# EAGLE board Arduino101 (EAGLE 7.7.0), part 1 of 2
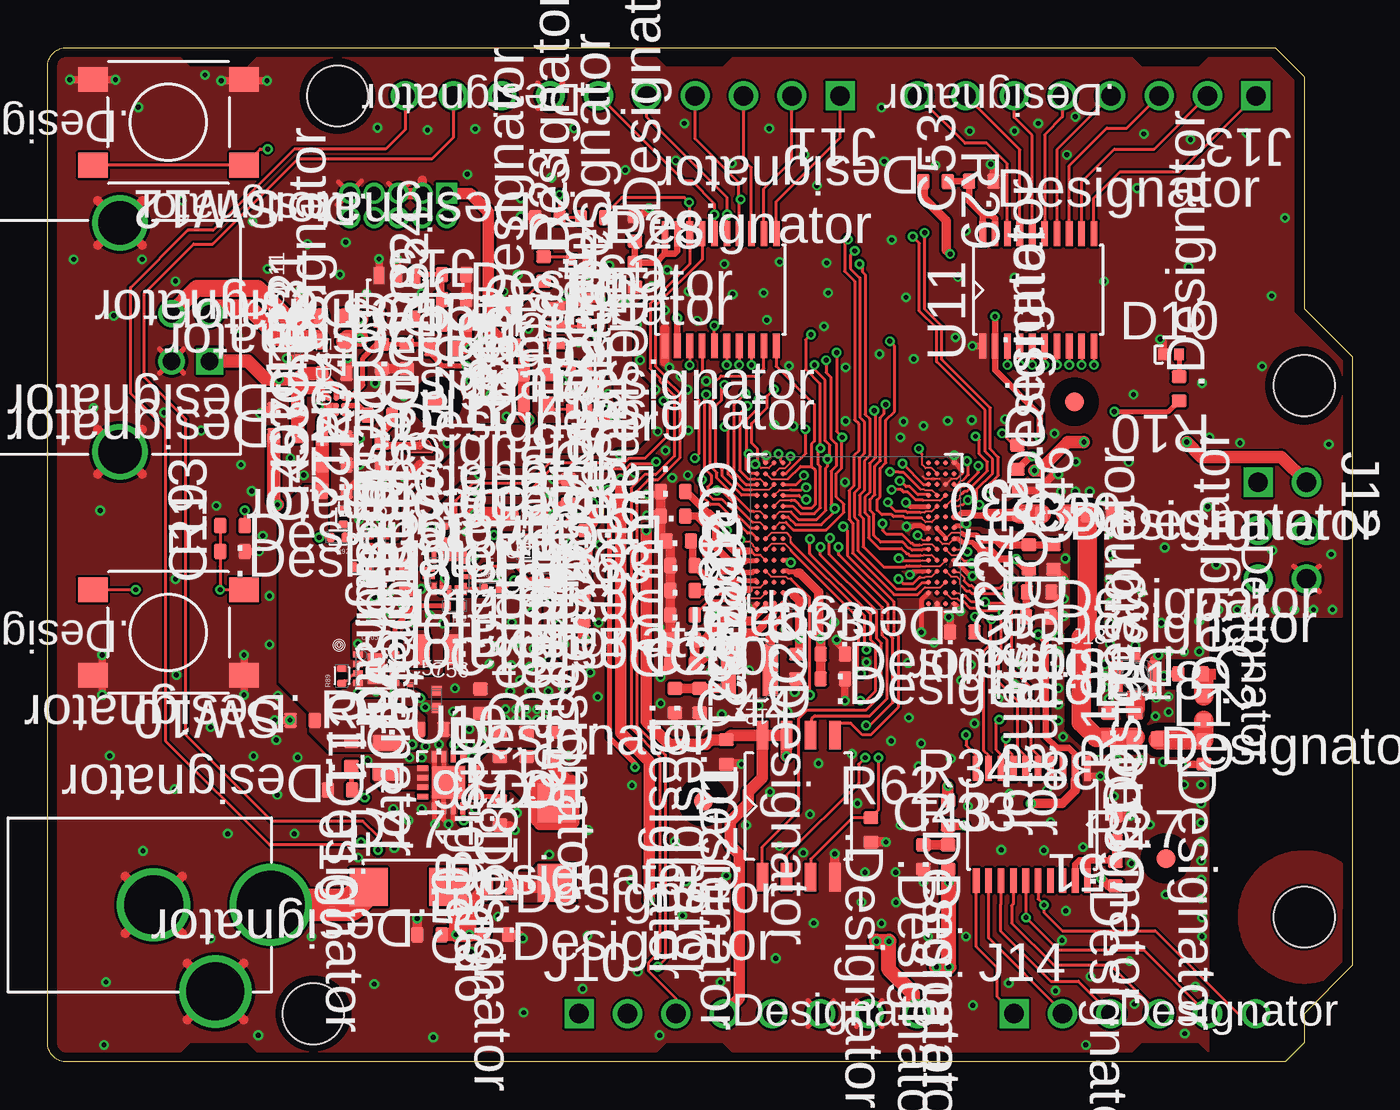
[diagram p6: board, top side]
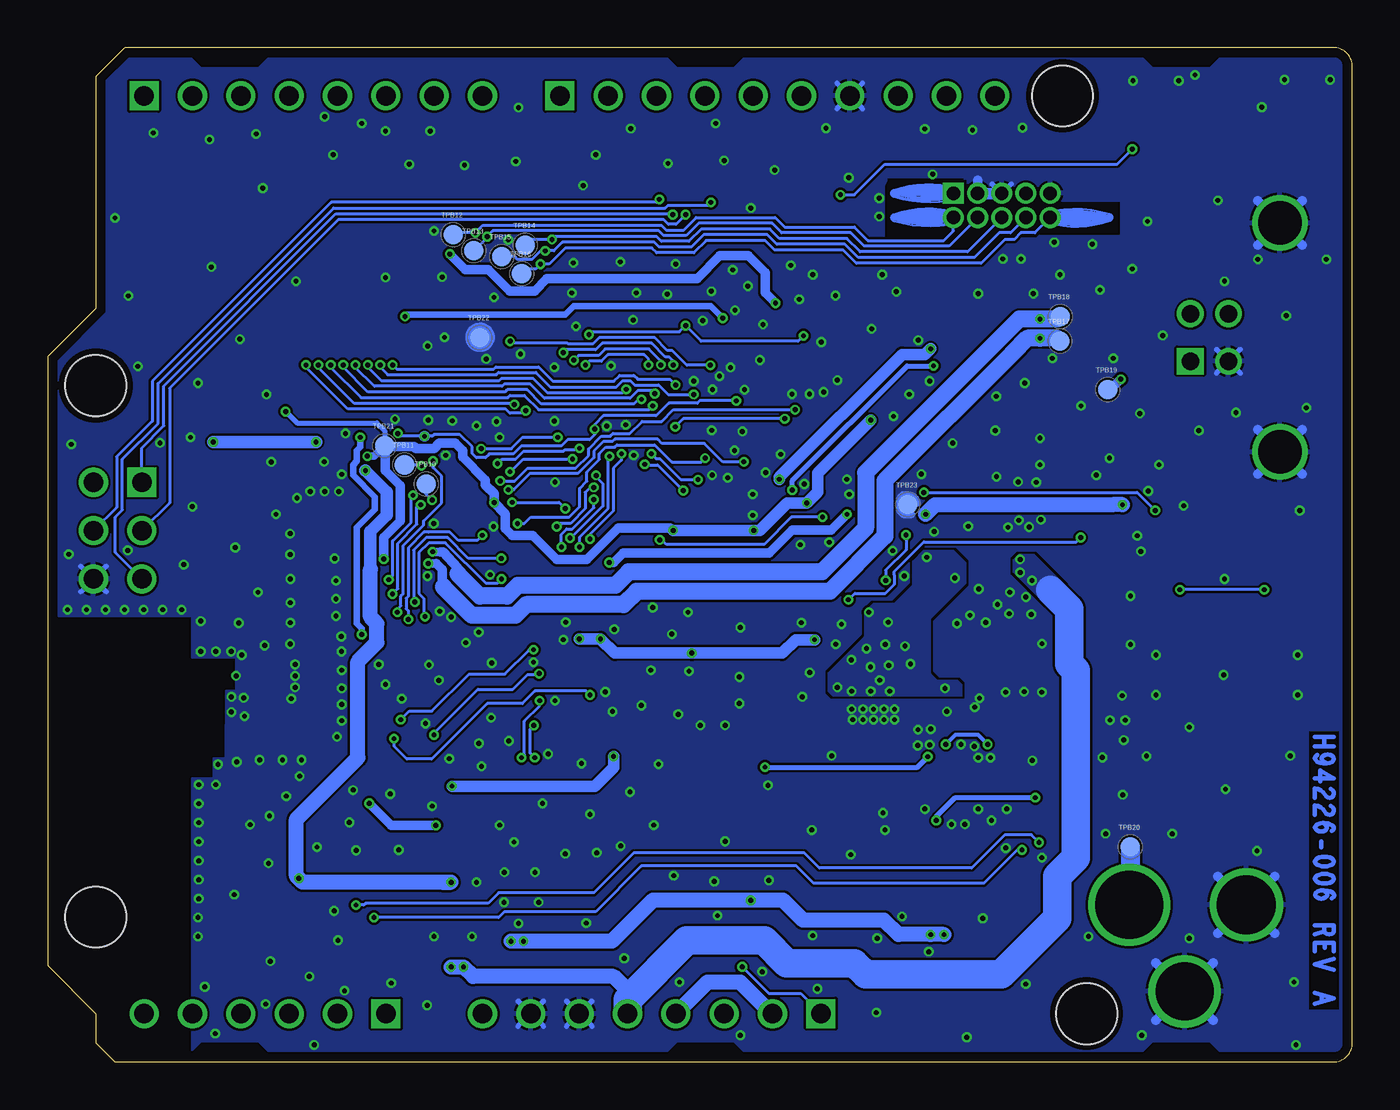
[diagram p7: board, bottom side, seen from below]

Size 68.58 x 53.34 mm. Coordinates in mm from the lower left corner, seen from the top.
Outline: 65.04,0 66.04,1 66.04,1.05 66.04,2.54 68.58,5.08 68.58,37.08 66.04,39.62 66.04,51.82 64.52,53.34 1,53.34 arc90 0,52.34 0,1 arc90 1,0 65.04,0
Copper layers (1+2+3*14+15+16): Top 0.035mm / dielectric 0.15mm / Route2 0.035mm / dielectric 0.15mm / Route3 0.035mm / dielectric 0.2mm / Route14 0.035mm / dielectric 0.15mm / Route15 0.035mm / dielectric 0.15mm / Bottom 0.035mm
Design rules "default *": minimum track width 0.075mm, minimum drill 0.25mm, track to track 5mil, track to pad 5mil, pad to pad 5mil, via to via 4mil, smd to smd 5mil, copper to edge 0.125mm, drill to drill 8mil, minimum pad ring 8mil, minimum via ring 5mil, stop-mask expansion 0mil, vias tented up to drill 20mil, thermal gap 5mil
Net classes: 0 default: width 0.102 mm, drill 0.203 mm; 1 RF: width 0.178 mm, drill 0.203 mm; 2 PWR: width 0.508 mm, drill 0.203 mm; 3 DIFF100: width 0.102 mm, drill 0.203 mm, clearance 0.157 mm
Holes 3.2 mm at 15.24,50.8 66.04,35.56 66.04,7.62 13.97,2.54
tRestrict: area 48.4,16.2 to 60,29.6; area 56.4,18 to 56.8,19.5; area 57.5,17.7 to 58,19.5; area 15,27.3 to 15.6,27.8; area 16.3,25.8 to 16.7,26.3; area 21.1,23.7 to 21.6,24.2; area 25.1,26.4 to 25.5,26.9; area 20.6,27.6 to 21.1,28; area 15.3,28.5 to 15.8,28.9; area 20.3,34.6 to 20.6,34.8; area 52.8,33.6 to 55.1,35.8; area 53.2,33.9 to 54.8,35.5; area 53.8,34.6 to 54.1,34.8; area 34.3,13.6 to 34.6,13.8; area 64.8,6.4 to 67.3,8.9; area 65.7,7.3 to 66.4,8; area 65.5,35.1 to 66.6,36.1; area 13.8,49.3 to 16.7,52.3; area 14.7,50.3 to 15.8,51.3; area 12.5,1.1 to 15.5,4; area 13.4,2 to 14.5,3.1; area 19.4,33.6 to 21.5,35.8; area 33.4,12.6 to 35.5,14.8; area 57.7,9.6 to 59.8,11.8; area 64.2,33.8 to 67.8,37.4; area 5.9,36.2 to 7.1,37.5; area 2.4,42.7 to 5.2,45.5; area 2.4,30.7 to 5.2,33.4; area 4.2,6.8 to 7,9.7; area 4.7,7.4 to 6.5,9.2; area 3.8,6.4 to 7.4,10.1; area 7,1.9 to 10.7,5.5; area 7.9,2.8 to 9.7,4.6; area 7.4,2.3 to 10.3,5.1; area 15.5,45.2 to 16.3,46.1; area 18,45.2 to 18.9,46.1; area 19.3,45.3 to 20.1,46.1; area 25.8,50.2 to 27.1,51.4; area 65.5,24.7 to 66.8,26.1; area 40,1.9 to 41.3,3.2; area 42.5,1.9 to 43.8,3.2; area 47.3,28 to 48.3,28.6; area 23.2,24.5 to 23.5,25.2
bRestrict: area 12.2,43.4 to 24.6,46.4; area 12.1,0.7 to 15.9,4.4; area 64.1,33.6 to 68,37.5; area 13.3,48.9 to 17.1,52.7; area 0.7,2.8 to 2.3,17.4

## Footprints (pad centres in the part's own frame; a part is rotated, then mirrored left to right if it is on the bottom)
0603X90H = smd 0.8 x 0.68: 1 0,0.64; 2 0,-0.64
CAP0402 = smd 0.508 x 0.508: 1 0,0.457; 2 0,-0.457
CAP0201 = smd 0.305 x 0.229: 1 0,0.254; 2 0,-0.254
LED_100X60X25H_SMLP13 = smd 0.5 x 0.6: 1 0.425,0; 2 -0.425,0
DIO2_450X260X220H = smd 2 x 2: 1 2.1,0; 2 -2.1,0
DIO_SOD882 = smd 0.305 x 0.559: 1 -0.356,0; 2 0.356,0
CONF1X8-254P_2104X240X850H_TH = drill 1.02 pad 1.52 square: 1 -8.89,0 | drill 1.02 pad 1.52: 2 -6.35,0; 3 -3.81,0; 4 -1.27,0; 5 1.27,0; 6 3.81,0; 7 6.35,0; 8 8.89,0
CONF1X10-254P_2612X240X850H_TH = drill 1.02 pad 1.52 square: 1 -11.43,0 | drill 1.02 pad 1.52: 2 -8.89,0; 3 -6.35,0; 4 -3.81,0; 5 -1.27,0; 6 1.27,0; 7 3.81,0; 8 6.35,0; 9 8.89,0; 10 11.43,0
CONM2X3-254P_762X500X860H_TH = drill 1.02 pad 1.52 square: 1 -2.54,-1.27 | drill 1.02 pad 1.52: 2 -2.54,1.27; 3 0,-1.27; 4 0,1.27; 5 2.54,-1.27; 6 2.54,1.27
CONF1X6-254P_1596X240X850H_TH = drill 1.02 pad 1.52 square: 1 -6.35,0 | drill 1.02 pad 1.52: 2 -3.81,0; 3 -1.27,0; 4 1.27,0; 5 3.81,0; 6 6.35,0
CONM2X5-127P_1270X559X533H = drill 0.7 pad 1.06 square: 1 -2.54,-0.635 | drill 0.7 pad 1.06: 2 -2.54,0.635; 3 -1.27,-0.635; 4 -1.27,0.635; 5 0,-0.635; 6 0,0.635; 7 1.27,-0.635; 8 1.27,0.635; 9 2.54,-0.635; 10 2.54,0.635
CON_JACK_880X1350X1135H_EJ508A = drill 3.56 pad 4.32: 1 -0.925,5.85 | drill 3.05 pad 3.81: 2 3.625,2.94 | drill 3.1 pad 3.86: 3 -0.925,-0.31
CON_USB_1204X1650X1115_AUY1007 = drill 0.92 pad 1.4 square: 1 -1.25,-6.76 | drill 0.92 pad 1.4: 2 1.25,-6.76; 3 1.25,-4.76; 4 -1.25,-4.76 | drill 2.3 pad 2.9: 5 -6.02,-2.05; 6 6.02,-2.05
CONN_COAX_MHF4 = smd 0.6 x 0.5: 1 0,-1.001 | smd 0.5 x 1.58: 2 -1,0; 4 1,0 | smd 0.5 x 0.5: 3 0,1.001
0806X100H = smd 0.8 x 1.6: 1 -0.8,0; 2 0.8,0
COIL_300X300X120H_NRH3012 = smd 0.787 x 2.692: 1 -1.1,0; 2 1.1,0
SMR0402 = smd 0.508 x 0.385: 1 0,0.383; 2 0,-0.383
SHORT_140X180 = smd 0.025 x 0.025: 1 0,0.5; 2 0,-0.5
SW4_600X600X430H_SM_PTS645 = smd 1.55 x 1.3: 1 -3.975,2.25; 2 3.975,2.25; 3 -3.975,-2.25; 4 3.975,-2.25
TP40 = smd 1.016 x 1.016: 1 0,0
QFN16-50P_300X300X100H_TR = smd 0.6 x 0.27: 1 -1.35,0.75; 2 -1.35,0.25; 3 -1.35,-0.25; 4 -1.35,-0.75; 9 1.35,-0.75; 10 1.35,-0.25; 11 1.35,0.25; 12 1.35,0.75 | smd 0.27 x 0.6: 5 -0.75,-1.35; 6 -0.25,-1.35; 7 0.25,-1.35; 8 0.75,-1.35; 13 0.75,1.35; 14 0.25,1.35; 15 -0.25,1.35; 16 -0.75,1.35 | smd 1.7 x 1.7: 17 0,0
SOIC20-65P_440X650X120H = smd 1.3 x 0.35: 1 -2.95,2.925; 2 -2.95,2.275; 3 -2.95,1.625; 4 -2.95,0.975; 5 -2.95,0.325; 6 -2.95,-0.325; 7 -2.95,-0.975; 8 -2.95,-1.625; 9 -2.95,-2.275; 10 -2.95,-2.925; 11 2.95,-2.925; 12 2.95,-2.275; 13 2.95,-1.625; 14 2.95,-0.975; 15 2.95,-0.325; 16 2.95,0.325; 17 2.95,0.975; 18 2.95,1.625; 19 2.95,2.275; 20 2.95,2.925
BGA111_14X24-57P_805X1100X150H = smd 0.254 x 0.254: A2 3.705,4.73; A3 3.705,4.28; A4 3.705,3.83; A21 3.705,-3.83; A22 3.705,-4.28; A23 3.705,-4.73; A24 3.705,-5.18; B1 3.135,5.18; B2 3.135,4.73; B3 3.135,4.28; B4 3.135,3.83; B21 3.135,-3.83; B22 3.135,-4.28; B23 3.135,-4.73; B24 3.135,-5.18; C1 2.565,5.18; C2 2.565,4.73; C3 2.565,4.28; C4 2.565,3.83; C21 2.565,-3.83; C22 2.565,-4.28; C23 2.565,-4.73; C24 2.565,-5.18; D1 1.995,5.18; D2 1.995,4.73; D3 1.995,4.28; D4 1.995,3.83; D21 1.995,-3.83; D22 1.995,-4.28; D23 1.995,-4.73; D24 1.995,-5.18; E1 1.425,5.18; E2 1.425,4.73; E3 1.425,4.28; E4 1.425,3.83; E21 1.425,-3.83; E22 1.425,-4.28; E23 1.425,-4.73; E24 1.425,-5.18; F1 0.855,5.18; F2 0.855,4.73; F3 0.855,4.293; F4 0.855,3.83; F21 0.855,-3.83; F22 0.855,-4.28; F23 0.855,-4.73; F24 0.855,-5.18; G1 0.285,5.18; G2 0.285,4.73; G3 0.285,4.28; G4 0.285,3.83; G21 0.285,-3.83; G22 0.285,-4.28; G23 0.285,-4.73; G24 0.285,-5.18; H1 -0.285,5.18; H2 -0.285,4.73; H3 -0.285,4.28; H4 -0.285,3.83; H21 -0.285,-3.83; H22 -0.285,-4.28; H23 -0.285,-4.73; H24 -0.285,-5.18; J1 -0.855,5.18; J2 -0.855,4.73; J3 -0.855,4.28; J4 -0.855,3.83; J21 -0.855,-3.83; J22 -0.855,-4.28; J23 -0.855,-4.73; J24 -0.855,-5.18; K1 -1.425,5.18; K2 -1.425,4.73; K3 -1.425,4.28; K4 -1.425,3.83; K21 -1.425,-3.83; K22 -1.422,-4.28; K23 -1.425,-4.73; K24 -1.425,-5.18; L1 -1.995,5.18; L2 -1.995,4.73; L3 -1.995,4.28; L4 -1.995,3.83; L21 -1.995,-3.83; L22 -1.995,-4.28; L23 -1.995,-4.73; L24 -1.995,-5.18; M1 -2.565,5.18; M2 -2.565,4.73; M3 -2.565,4.28; M4 -2.565,3.83; M21 -2.565,-3.83; M22 -2.565,-4.28; M23 -2.565,-4.73; M24 -2.565,-5.18; N1 -3.135,5.18; N2 -3.135,4.73; N3 -3.135,4.28; N4 -3.135,3.83; N21 -3.135,-3.83; N22 -3.135,-4.28; N23 -3.135,-4.73; N24 -3.135,-5.18; P1 -3.705,5.18; P2 -3.705,4.73; P3 -3.705,4.28; P4 -3.705,3.83; P21 -3.705,-3.83; P22 -3.705,-4.28; P23 -3.705,-4.73; P24 -3.705,-5.18
BGA9_3X3-40P_121X121X63H = smd 0.28 x 0.28: 1 -0.4,0.4; 2 0,0.4; 3 0.4,0.4; 4 -0.4,0; 5 0,0; 6 0.4,0; 7 -0.4,-0.4; 8 0,-0.4; 9 0.4,-0.4
SOT23-5_160X290X145H = smd 0.9 x 0.55: 1 -1.15,0.95; 2 -1.15,0; 3 -1.15,-0.95; 4 1.15,-0.95; 5 1.15,0.95
SOIC8-127P_528X528X216H_1PRIMARY = smd 1.5 x 0.6: 1 -3.725,1.905; 2 -3.725,0.635; 3 -3.725,-0.635; 4 -3.725,-1.905; 5 3.725,-1.905; 6 3.725,-0.635; 7 3.725,0.635; 8 3.725,1.905
SOT23-5_160X290X120H = smd 0.9 x 0.55: 1 -1.15,0.95; 2 -1.15,0; 3 -1.15,-0.95; 4 1.15,-0.95; 5 1.15,0.95
LCC4_P4MM_SQ1MM = smd 0.2 x 0.2: 1 -0.457,0.203; 2 -0.406,-0.203; 3 0.406,-0.203; 4 0.457,0.203
STQFN14_2_40MA = smd 0.635 x 0.229: 1 0,0; 5 0,-1.599; 8 1.663,-1.599; 12 1.663,0 | smd 0.508 x 0.229: 2 -0.064,-0.4; 3 -0.064,-0.8; 4 -0.064,-1.199; 9 1.727,-1.199; 10 1.727,-0.8; 11 1.727,-0.4 | smd 0.229 x 0.635: 6 0.632,-1.879; 7 1.032,-1.879; 13 1.032,0.28; 14 0.632,0.28
USON8_5MM_2X2MM-DIE = smd 0.508 x 0.305: 1 -0.954,0.75; 2 -0.954,0.25; 3 -0.954,-0.25; 4 -0.954,-0.75; 5 0.954,-0.75; 6 0.954,-0.25; 7 0.954,0.25; 8 0.954,0.75 | smd 0.914 x 1.6: 9 0,0
FIDUCIAL_40 = smd 1 x 1: 1 0,0

## Placement (x,y rotation side)
C1  1.2pF  [0603X90H]  60.77,18.6 180 top
C2  0.1uF  [0603X90H]  60.07,20.4 270 top
C3  10pF  [0603X90H]  52.87,28.8 90 top
C11  4.7uF  [0603X90H]  13.41,17.96 270 top
C12  4.7uF  [0603X90H]  25.17,16.7 180 top
C13  10uF  [0603X90H]  22.74,18.98 0 top
C14  22uF  [0603X90H]  20.17,17.5 90 top
C15  0.033uF  [0603X90H]  23.77,13.1 0 top
C16  4.7uF  [0603X90H]  23.77,16.7 180 top
C17  4.7uF  [0603X90H]  27.37,30 180 top
C18  4.7uF  [0603X90H]  15.07,36.2 90 top
C19  33pF  [0603X90H]  9.72,26.85 90 top
C20  10uF  [0603X90H]  52.87,26.55 0 top
C21  4.7uF  [0603X90H]  52.12,24.71 90 top
C22  0.1uF  [0603X90H]  52.07,23.41 90 top
C23  10uF  [0603X90H]  33.17,27.4 270 top
C24  0.1uF  [0603X90H]  33.37,26.1 270 top
C25  4.7uF  [0603X90H]  41.27,21.45 90 top
C26  0.1uF  [0603X90H]  41.27,20.15 90 top
C28  0.1uF  [0603X90H]  33.37,24.8 270 top
C29  4.7uF  [0603X90H]  32.97,19 0 top
C30  0.1uF  [0603X90H]  34.27,19 0 top
C31  4.7uF  [0603X90H]  33.37,20.9 270 top
C32  0.1uF  [0603X90H]  33.37,22.2 270 top
C33  4.7uF  [0603X90H]  39.37,20.8 0 top
C35  0.1uF  [0603X90H]  32.87,30 270 top
C36  0.1uF  [0603X90H]  20.07,6.7 270 top
C38  0.1uF  [0603X90H]  55.77,17.7 180 top
C39  0.1uF  [0603X90H]  15.07,32.8 90 top
C41  33pF  [0603X90H]  26.27,44.4 270 top
C42  4.7uF  [0603X90H]  12.52,34.3 270 top
C43  0.1uF  [0603X90H]  46.03,10.78 0 top
C44  0.1uF  [0603X90H]  35.67,16.3 0 top
C45  0.1uF  [0603X90H]  33.37,23.5 270 top
C46  0.1uF  [0603X90H]  55.27,28.8 90 top
C47  0.1uF  [0603X90H]  51.07,29.4 180 top
C48  0.1uF  [0603X90H]  32.87,28.7 270 top
C49  10uF  [0603X90H]  15.07,30 90 top
C50  4.7uF  [0603X90H]  23.57,6.7 90 top
C51  0.1uF  [0603X90H]  56.12,12.3 180 top
C52  0.1uF  [0603X90H]  30.87,43.8 180 top
C53  0.1uF  [0603X90H]  49.07,46.3 90 top
C54  0.1uF  [0603X90H]  21.37,41.4 90 top
C55  0.1uF  [0603X90H]  18.87,37.1 0 top
C56  22uF  [CAP0402]  20.45,19.07 0 top
C57  0.1uF  [CAP0201]  19.07,19.58 0 top
C58  0.1uF  [0603X90H]  18.86,25.47 0 top
D10  LED_SML-P12PTT86  [LED_100X60X25H_SMLP13]  59.05,37.21 0 top
D13  LED_SML-P12PTT86  [LED_100X60X25H_SMLP13]  27.94,42.16 180 top
D14  LED_SML-P12PTT86  [LED_100X60X25H_SMLP13]  27.94,36.58 180 top
D15  LED_SML-P11UTT86  [LED_100X60X25H_SMLP13]  27.94,34.29 180 top
D17  DIO_RSX501L-20TE25  [DIO2_450X260X220H]  18.97,9.2 0 top
D18  DIO_RSX501L-20TE25  [DIO2_450X260X220H]  26.77,11.51 90 top
DRILEGEND  [DRILEGEND]  185.73,-23.51 0 top  (outside the outline)
ESD10  PESD5V0X1BCAL,315  [DIO_SOD882]  13.27,37.4 270 top
ESD11  PESD5V0X1BCAL,315  [DIO_SOD882]  13.27,39.7 90 top
FB1  FERRITE_BEAD_0603_BLM18KG331SN1D  [0603X90H]  23.72,9.2 90 top
J10  CON_1X8_2211-08-S-02-3.2  [CONF1X8-254P_2104X240X850H_TH]  36.83,2.54 0 top
J11  CON_1X10_2211-10-S-02  [CONF1X10-254P_2612X240X850H_TH]  30.23,50.8 180 top
J12  CON_2X3_2202-06-S-02-6.0  [CONM2X3-254P_762X500X860H_TH]  64.9,27.94 270 top
J13  CON_1X8_2211-08-S-02-3.2_IO  [CONF1X8-254P_2104X240X850H_TH]  54.61,50.8 180 top
J14  CON_1X6_2211-06-S-02-3.2  [CONF1X6-254P_1596X240X850H_TH]  57.15,2.54 0 top
J15  CON_JTAG_20021111-00010T4LF  [CONM2X5-127P_1270X559X533H]  18.43,45.04 180 top
J16  CON_DC_PWR_JACK  [CON_JACK_880X1350X1135H_EJ508A]  5.88,7.34 270 top
J17  CON_USB_TYPE_B  [CON_USB_1204X1650X1115_AUY1007]  1.76,38.1 90 top
J18  20449-001E-01  [CONN_COAX_MHF4]  57.17,20.3 0 top
L1  4.7nH  [0603X90H]  60.77,16.3 0 top
L10  2.2uH  [0806X100H]  17.87,16 90 top
L12  22uH  [COIL_300X300X120H_NRH3012]  36.87,20.6 180 top
L14  2.2uH  [0806X100H]  20.51,21.68 0 top
R10  330 ohm  [0603X90H]  59.47,35.4 180 top
R12  22 ohm  [0603X90H]  12.52,32.95 270 top
R13  100 ohm  [0603X90H]  9.72,28.2 90 top
R14  1K ohm  [0603X90H]  26.07,41.7 180 top
R15  330 ohm  [0603X90H]  25.67,36.2 90 top
R16  330 ohm  [0603X90H]  25.67,34.6 90 top
R18  0 ohm  [0603X90H]  57.17,17.7 0 top
R19  0 ohm  [0603X90H]  57.67,17 90 top
R23  100 ohm  [0603X90H]  28.67,44.4 90 top
R24  0 ohm  [0603X90H]  48.07,22.6 270 top
R27  200K ohm  [0603X90H]  56.12,9.9 0 top
R28  200K ohm  [0603X90H]  30.87,41.4 0 top
R29  200K ohm  [0603X90H]  46.67,46.3 270 top
R30  10K ohm  [0603X90H]  50.97,31.8 180 top
R31  22 ohm  [0603X90H]  14.97,39.2 90 top
R32  22 ohm  [0603X90H]  14.97,37.9 90 top
R33  10K ohm  [0603X90H]  47.33,10.78 0 top
R34  1.8K ohm  [0603X90H]  47.33,13.08 0 top
R35  22 ohm  [0603X90H]  51.57,26.55 0 top
R57  10K ohm  [0603X90H]  15.07,31.4 90 top
R58  6.8 ohm  [0603X90H]  28.27,27.3 180 top
R59  0 ohm  [0603X90H]  25.08,28.8 270 top
R62  10K ohm  [0603X90H]  43.27,12.2 0 top
R63  6.8 ohm  [0603X90H]  28.16,23.83 0 top
R65  200K ohm  [0603X90H]  28.22,39.45 180 top
R70  10K ohm  [0603X90H]  15.97,16.2 0 top
R71  10K ohm  [0603X90H]  15.37,14.3 270 top
R73  402 ohm  [0603X90H]  17.57,31.9 0 top
R74  698 ohm  [0603X90H]  17.47,34 90 top
R75  1K ohm  [0603X90H]  17.57,37.1 0 top
R77  10K ohm  [0603X90H]  26.57,16.7 180 top
R81  3K ohm  [0603X90H]  20.77,37.5 270 top
R82  10K ohm  [0603X90H]  21.37,40.1 90 top
R83  1.5K ohm  [0603X90H]  21.37,38.8 270 top
R84  10M ohm  [SMR0402]  25.26,26.69 270 top
R86  10M ohm  [SMR0402]  20.83,27.79 180 top
R88  280 ohm  [SMR0402]  23.35,24.89 270 top
R89  100 ohm  [SMR0402]  15.46,20.3 0 top
R90  100K ohm  [SMR0402]  21.39,23.99 90 top
R91  10M ohm  [SMR0402]  15.54,28.67 180 top
R92  100 ohm  [SMR0402]  15.27,27.59 90 top
R93  0 ohm  [SMR0402]  16.48,26.03 90 top
SH10  openPAD  [SHORT_140X180]  19.57,31.9 0 top
SW10  SWITCH_PTS645-S-M-43-SMTR92-LFS  [SW4_600X600X430H_SM_PTS645]  6.35,22.59 180 top
SW12  SWITCH_PTS645-S-M-43-SMTR92-LFS  [SW4_600X600X430H_SM_PTS645]  6.35,49.41 180 top
TPB10  TESTPAD  [TP40]  48.67,30.4 0 bottom
TPB11  TESTPAD  [TP40]  49.82,31.4 0 bottom
TPB12  TESTPAD  [TP40]  47.27,43.5 0 bottom
TPB13  TESTPAD  [TP40]  46.17,42.65 0 bottom
TPB14  TESTPAD  [TP40]  43.47,42.95 0 bottom
TPB15  TESTPAD  [TP40]  44.72,42.35 0 bottom
TPB16  TESTPAD  [TP40]  43.67,41.45 0 bottom
TPB17  TESTPAD  [TP40]  15.37,37.9 0 bottom
TPB18  TESTPAD  [TP40]  15.37,39.2 0 bottom
TPB19  TESTPAD  [TP40]  12.87,35.35 0 bottom
TPB20  TESTPAD  [TP40]  11.67,11.3 0 bottom
TPB21  TESTPAD  [TP40]  50.87,32.4 0 bottom
TPB22  TESTPAD  [TP40]  45.87,38.1 0 bottom
TPB23  TESTPAD  [TP40]  23.37,29.3 0 bottom
U10  TPS62153RGTR  [QFN16-50P_300X300X100H_TR]  21.07,14.7 0 top
U11  IC_LSF0108PWR  [SOIC20-65P_440X650X120H]  52.07,40.6 90 top
U12  CURIE  [BGA111_14X24-57P_805X1100X150H]  42.47,27.8 90 top
U13  FPF2496UCX_WLCSP_VREG  [BGA9_3X3-40P_121X121X63H]  15.17,34.5 90 top
U14  IC_LSF0108PWR  [SOIC20-65P_440X650X120H]  35.38,40.6 90 top
U15  IC_LSF0108PWR  [SOIC20-65P_440X650X120H]  51.74,12.48 270 top
U16  SN74AUP1G34DBVR  [SOT23-5_160X290X145H]  25.57,38.7 180 top
U201  IC_MX25V1635FM2I_FLASH  [SOIC8-127P_528X528X216H_1PRIMARY]  39.47,13.45 90 top
U202  R3119-VREG  [SOT23-5_160X290X120H]  18.37,40.2 270 top
U203  SLG5NT1593V  [LCC4_P4MM_SQ1MM]  26.07,25.2 0 top
U204  SLG7NT41502VTR  [STQFN14_2_40MA]  21.91,26.54 270 top
U205  TPS62162DSG  [USON8_5MM_2X2MM-DIE]  17.27,20.68 0 top
U206  SLG5NT15944V  [LCC4_P4MM_SQ1MM]  17.22,27.39 0 top
U$1  FIDUCIAL_40  [FIDUCIAL_40]  20.47,34.7 0 top
U$2  FIDUCIAL_40  [FIDUCIAL_40]  53.97,34.7 0 top
U$3  FIDUCIAL_40  [FIDUCIAL_40]  58.77,10.7 0 top
U$4  FIDUCIAL_40  [FIDUCIAL_40]  34.47,13.7 0 top

## Tracks (layer width: path | path; a pad name or v marks a point on that pad's centre or on a via)
AD0
  Top 0.15: U15.11 48.81,6.06 49.92,4.95 49.92,3.42 J14.1 | U15.11 | U15.11
AD1
  Top 0.15: U15.12 49.46,6.53 53.34,2.64 J14.2
AD2
  Top 0.15: U15.13 50.11,8.31 50.07,8.27 50.07,6.9 52.72,4.25 54.17,4.25 J14.3
AD3
  Top 0.15: U15.14 50.76,8.31 50.67,8.22 50.67,7.3 52.87,5.1 55.86,5.1 J14.4 | U15.14 | U15.14
AD4_SDA  (via drill 0.25 pad 0.5, 0.25 pad 0.51)
  Top 0.15: v17.37,11.15 17.37,11.85 16.57,12.65 11.82,12.65 7.27,17.2 7.27,33.8 5.07,36 5.07,40.4 7.67,43 8.67,43 13.17,47.5 20.22,47.5 21.34,48.62 J11.9 | U15.15 51.41,7.62 v51.42,7.6 v51.42,7.59 51.44,7.57 | 51.44,7.57 53.11,5.9 57.6,5.9 J14.5 | U15.15 | U15.15 | v51.42,7.6 51.44,7.57
  Bottom 0.15: v51.42,7.6 44.87,7.6 44.57,7.9 39.77,7.9 37.37,10.3 29.22,10.3 28.32,9.4 19.37,9.4 17.62,11.15 v17.37,11.15
AD5_SCL  (via drill 0.25 pad 0.5, 0.25 pad 0.51)
  Top 0.075: 4.35,40.7 4.37,40.7 4.37,40.73 | 4.35,35.18 4.37,35.15
  Top 0.15: J11.10 18.8,50.3 18.8,49.03 17.77,48 12.97,48 8.7,43.73 7.37,43.73 4.37,40.73 | 4.37,35.15 6.22,33.3 6.22,16.85 11.67,11.4 16.32,11.4 v16.47,11.55 | 4.35,40.7 4.35,35.18 | U15.16 52.06,8.57 v52.37,8.25 52.37,7.85 53.32,6.9 58.22,6.9 62.58,2.54 J14.6 | U15.16 | U15.16
  Top 0.406: J11.10 18.8,50.3
  Bottom 0.15: v52.37,8.25 | v52.37,8.25 51.97,8.25 51.87,8.35 45.42,8.35 44.87,8.9 39.87,8.9 37.77,11 28.82,11 28.02,10.2 20.02,10.2 18.27,11.95 16.87,11.95 v16.47,11.55 | v52.37,8.25
AD09/SS1_3V_AD5  (via drill 0.25)
  Top 0.075: U12.N24
  Top 0.116: U12.N24 47.68,24.63 47.91,24.63 48.04,24.51 48.07,24.51 | U12.K21 45.97,26.38 45.95,26.36 45.87,26.36
  Top 0.15: 48.07,24.51 48.24,24.51 48.56,24.19 48.94,24.19 v49.27,24.19 v49.28,24.19 49.34,24.13 50.37,24.13 50.65,23.85 50.65,20.72 51.67,19.7 51.67,16.5 52.06,16.11 U15.5 | 45.87,26.36 44.86,26.36 v44.73,26.48
  Bottom 0.15: v44.73,26.48 46.46,26.48 47.55,27.58 48.69,27.58 49.34,26.92 49.34,24.39 49.27,24.32 v49.27,24.19
AD10/SS2_3V_AD0  (via drill 0.25 pad 0.5)
  Top 0.116: U12.J2 38.03,27.23 38.78,27.23 39.07,26.94 39.07,26.9
  Top 0.15: 39.07,26.9 42.65,23.33 42.65,22.05 42.57,21.98 42.57,20.6 v42.75,20.43 v42.74,20.43 | U12.J2 | U15.10 48.81,16.11 48.27,16.65 v48.27,17.2
  Bottom 0.15: v48.27,17.2 48.27,17.3 45.97,19.6 44.12,19.6 43.34,20.38 42.8,20.38 v42.75,20.42 v42.74,20.43
AD11/SS3_3V_AD1  (via drill 0.25, 0.25 pad 0.5)
  Top 0.116: v45.73,27.7 45.97,27.45 46.24,27.45 U12.H21
  Top 0.15: U15.9 49.46,16.12 49.21,16.36 49.21,21.62 49.57,21.97 49.57,23.23 v49.62,23.28 v49.62,23.27 | v45.73,27.7 v45.73,27.69
  Bottom 0.075: 47.44,27.85 47.42,27.85 | 48.57,27.85 48.57,27.86
  Bottom 0.15: 48.57,27.86 48.8,27.86 49.62,27.03 49.62,24.49 49.73,24.38 49.73,23.83 49.62,23.72 v49.62,23.27 | 47.44,27.85 48.57,27.85 | 47.44,27.85 47.42,27.85 46.99,27.43 45.99,27.43 v45.73,27.69 v45.73,27.7
AD12/SS4_3V_AD2  (via drill 0.25 pad 0.5)
  Top 0.116: U12.H2 38.03,27.8 38.87,27.8 39.07,27.6 39.07,27.33
  Top 0.15: 39.07,27.33 42.95,23.45 42.95,21.78 v43.05,21.68 | U12.H2 | U15.8 50.11,16.16 49.87,16.4 49.87,17.85 v50.02,18
  Bottom 0.15: v43.05,21.68 43.27,21.68 44.55,20.4 46.43,20.4 48.38,18.45 49.57,18.45 v50.02,18
AD13/SS5_3V_AD3  (via drill 0.25 pad 0.5)
  Top 0.116: U12.L2 38.03,25.52 38.8,25.52 38.9,25.43 39.05,25.43 39.07,25.4
  Top 0.15: 39.07,25.4 40.02,24.45 40.02,19.35 v40.07,19.3 | U12.L2 | U15.7 50.67,15.52 50.67,16.2 50.37,16.5 v50.37,17
  Bottom 0.15: v40.07,19.3 40.27,19.5 42.97,19.5 43.62,18.85 45.47,18.85 48.39,15.93 49.69,15.93 50.37,16.6 v50.37,17
AD14/SS6_3V_AD4  (via drill 0.25)
  Top 0.116: 48.07,24.23 47.97,24.23 47.82,24.38 47.49,24.38 U12.N23 | 48.17,30.65 48.08,30.56 48.03,30.56 47.84,30.37 U12.C24
  Top 0.15: 48.07,24.23 48.12,24.23 48.47,23.88 48.94,23.88 49.08,23.73 50.12,23.73 v50.2,23.65 | v50.2,23.65 50.1,23.55 50.1,21.65 49.97,21.53 49.97,20 50.97,19 50.97,16.5 51.41,16.07 U15.6 | 48.17,30.65 48.4,30.88 48.4,31.37 48.32,31.45 v48.32,31.6 | v50.2,23.65
  Bottom 0.15: v50.2,23.65 50.2,23.8 50.01,23.99 50.01,24.49 49.9,24.6 49.9,27.15 48.82,28.23 48.82,28.45 47.87,29.4 47.87,30.8 48.32,31.25 v48.32,31.6
ATPCTS/IO9_3V_IO14  (via drill 0.25 pad 0.5)
  Top 0.116: 45.84,27.19 45.98,27.19 46.02,27.23 46.47,27.23 U12.J22
  Top 0.15: U14.4 34.4,36.28 34.12,36 34.12,34.9 34.22,34.8 34.22,31.95 v34.02,31.75 | 45.84,27.19 45.54,27.19 45.45,27.28 45.38,27.28 44.9,27.75 44.08,27.75 43.88,27.95 v43.88,28.32
  Bottom 0.075: 41.56,28.65 41.56,28.64 | 41.18,28.64 41.17,28.64 41.17,28.65
  Bottom 0.15: v34.02,31.75 34.22,31.55 35.77,31.55 36.67,32.45 38.65,32.45 38.77,32.33 39.24,32.33 39.58,31.98 39.58,31.68 40.24,31.02 40.24,30.54 40.62,30.16 40.62,29.2 41.17,28.65 | 41.56,28.65 43.18,28.65 43.51,28.32 v43.88,28.32 v43.89,28.32 | 41.56,28.64 41.18,28.64
ATPMISO/IO1_3V_IO12  (via drill 0.25 pad 0.5)
  Top 0.116: U12.G3 38.48,28.37 38.8,28.37 | 45.96,31.95 45.96,31.41 46.15,31.22 46.47,31.22 U12.B22
  Top 0.15: 38.8,28.37 39.2,27.98 40.92,27.98 41.85,28.9 41.85,29.33 41.45,29.72 41.45,30.95 41.74,31.23 41.74,32.82 v41.77,32.85 | v41.77,32.85 41.47,33.15 v41.47,37.3 | U12.G3 | U14.6 v35.7,36.65 v35.69,36.65 v35.7,36.65 | U14.6 | U14.6 | 45.96,31.95 45.96,31.96 45.8,32.13 v45.8,32.25 | v41.77,32.85
  Bottom 0.15: v45.8,32.25 44.21,32.25 43.61,32.85 v41.77,32.85 | v35.7,36.65 35.7,36.86 35.91,37.07 36.11,37.07 36.83,37.79 39.43,37.79 39.77,37.45 41.32,37.45 v41.47,37.3
ATPMOSI/IO3_3V_IO11  (via drill 0.25 pad 0.5)
  Top 0.116: 45.87,28.89 46.08,28.89 46.14,28.94 46.47,28.94 U12.E22
  Top 0.15: v41.37,29.1 41.37,28.95 40.67,28.25 39.32,28.25 38.91,28.66 U12.F4 | v41.37,29.1 41.18,29.3 41.18,31.06 41.46,31.34 41.46,32.5 41.17,32.79 41.17,36 40.92,36.25 v40.92,36.9 | U14.7 v36.35,36.65 v36.34,36.65 v36.35,36.65 | 45.87,28.89 45.18,28.89 45.12,28.95 44.57,28.95 44.16,29.36 v44.16,29.43 | v41.37,29.1
  Bottom 0.15: v44.17,29.43 v44.16,29.43 41.7,29.43 v41.37,29.1 | v40.92,36.9 40.67,37.15 39.62,37.15 39.28,37.49 36.98,37.49 36.34,36.86 v36.34,36.65 v36.35,36.65
ATPSCK/IO2_3V_IO13  (via drill 0.25 pad 0.5)
  Top 0.15: R65.1 v28.85,38.18 | R65.1 28.11,38.7 U16.2 | R65.1 | v35.05,38.72 U14.5 | v40.62,32.27 40.5,32.15 40.5,31.42 40.62,31.3 40.62,29.15 40.3,28.83 39.56,28.83 39.16,29.23 U12.E4 | v40.62,32.27 40.59,32.3 40.59,35.68 39.84,36.43 39.84,37.97 v40.12,38.25 | U12.C21 46.04,30.37 v44.94,31.47 | v44.93,31.47 v44.94,31.47 | v44.94,31.47 v44.93,31.47 | v40.62,32.27
  Bottom 0.15: v35.05,38.72 34.23,37.9 29.13,37.9 v28.85,38.18 | v35.05,38.72 35.37,38.39 39.98,38.39 v40.12,38.25 | v44.93,31.47 44.7,31.7 43.98,31.7 43.56,32.12 41.47,32.12 41.39,32.19 40.7,32.19 v40.62,32.27 | v35.05,38.72
ATPSS/IO0_3V_IO10  (via drill 0.25 pad 0.5)
  Top 0.116: U12.F3 38.48,28.94 39.05,28.94 39.07,28.93 | 45.87,30.13 46.06,30.13 46.11,30.07 46.48,30.07 U12.D22
  Top 0.15: 39.07,28.93 39.47,28.53 40.43,28.53 40.9,29.01 40.9,31.23 41,31.33 v41,31.7 | v41,31.7 41.11,31.82 41.11,32.43 40.87,32.67 40.87,35.85 40.31,36.41 v40.31,36.65 | U12.F3 | U14.8 v37,36.65 v36.99,36.65 | U14.8 | U14.8 | 45.87,30.13 44.98,31.01 44.74,31.01 44.72,31.04 v44.27,31.04 | v40.99,31.7 v41,31.7
  Bottom 0.15: v40.99,31.7 43.57,31.7 44.23,31.04 v44.27,31.04 | v36.99,36.65 36.99,36.95 37.23,37.19 39.13,37.19 39.47,36.85 40.11,36.85 v40.31,36.65
AVD_OPM_2P6  (via drill 0.25, 0.25 pad 0.5)
  Top 0.116: U12.J1 37.07,27.17 37.07,27.2 36.9,27.37 36.5,27.37 36.42,27.45 v36.41,27.45
  Top 0.15: R88.1 24.09,24.89 v24.53,25.32 | U12.J1 | v36.41,27.45 36.42,27.45 | v27.85,28.65 27.44,28.65 26.49,27.71 v23.46,27.71
  Bottom 0.15: v23.46,27.71 23.46,26.93 24.53,25.86 v24.53,25.32 | v36.41,27.45 36.3,27.45 36.06,27.22 30.91,27.22 29.48,28.65 v27.85,28.65 | v36.41,27.45 36.42,27.45 36.41,27.46 v36.41,27.45
BATT_ISET  (via drill 0.25 pad 0.5)
  Top 0.116: 45.87,25.48 46.1,25.48 46.14,25.52 46.47,25.52 U12.L22
  Top 0.15: R24.1 48.75,22.64 v48.75,23.42 v48.74,23.42 | 45.87,25.48 45.82,25.48 45.5,25.15 44.97,25.15 v44.72,25.4 v44.73,25.4 v44.72,25.4
  Bottom 0.15: 44.96,25.16 45.53,25.16 47.67,27.3 48.55,27.3 49.07,26.78 49.07,24.64 48.8,24.37 48.8,23.47 v48.74,23.42 | v44.72,25.4 44.96,25.16 | 44.96,25.16 44.96,25.17 v44.72,25.4
BT_ANT_50
  Top 0.4: R19.1 57.11,17 R18.2 | C3.2
  Top 1.016: C3.2 C46.1 54.63,22.61 54.33,22.31 54.33,17.84 55.11,17.06 C38.1 | C38.1 R18.2 | C38.1
BT_ANT_50_R
  Top 0.4: R19.2
  Top 0.6: R19.2 58.37,16.94
  Top 1.016: 58.37,16.94 L1.1 | L1.1 C1.1 | C1.1 | C1.1 arc-45 C1.1 | L1.1
BT_ANT_EXT
  Top 0.25: J18.1 57.15,19.31
  Top 0.4: J18.1 57.09,19.3 56.86,19.08 56.86,18.65 R18.1 | 57.18,19.32 57.22,19.32 57.48,19.06 57.48,18.54 57.14,18.54 57.13,18.55 57.13,19.3 57.15,19.31
  pour Top (no thermals): 56.68,18.66 56.68,18.32 arc44 56.8,18.02 57.54,18.02 57.59,18.1 57.62,18.15 57.64,18.22 57.65,18.27 57.66,18.31 57.66,18.67
BT_ANT_INT
  Top 0.889: 60.77,20.25 arc45 C2.1
  Top 1.016: C1.2 60.77,20.25
BT_AOUT_50
  Top 0.35: 49.43,28.76 49.39,28.73 48.72,28.73 48.57,28.88 48.05,28.88 47.83,28.66 U12.F24
  Top 0.4: C3.1
  Top 0.65: 49.43,28.76 C47.1 51.11,28.76 51.11,28.8
  Top 1.016: 51.11,28.8 C3.1
BUCK_VOUT
  Top 0.25: 36.79,26.38 U12.K1 | C35.1
  Top 0.3: 36.66,26.35 36.69,26.38 36.79,26.38
  Top 0.4: C35.1 33.57,30 34.7,28.88 34.78,28.88 35.12,28.53 35.12,27.04 35.82,26.35 36.66,26.35
CURIE_VBUS  (via drill 0.25 pad 0.5, 0.25 pad 0.51)
  Top 0.65: R59.2 24.01,28.79
  Top 0.7: R12.2 11.88,32.95 11.88,29.51 v12.08,29.3
  Top 0.8: 24.01,28.79 v22.42,28.79 v22.43,28.8
  Bottom 0.8: v22.43,28.8 21.93,29.3 12.6,29.3 v12.08,29.3
D13
  Top 0.15: R14.2 27.34,42.34 D13.1
D13_R
  Top 0.075: R14.1
  Top 0.15: R14.1 26.01,41.06 25,40.05 24.6,39.65 U16.4 | U16.4 | U16.4
DBG_AP_JTAG_TCK  (via drill 0.25)
  Top 0.116: 48.07,25 47.95,25.13 47.95,25.37 47.8,25.52 47.49,25.52 U12.L23
  Top 0.15: 48.07,25 48.3,24.78 48.45,24.78 48.58,24.65 50.42,24.65 v50.45,24.61 | v48.97,29.3 48.92,29.35 48.92,29.45 48.85,29.53 48.85,30.13 49.67,30.95 49.67,31.7 49.27,32.1 49.27,34.27 46.72,36.82 46.72,38.57 45.82,39.48 45.82,43.05 v45.47,43.4
  Bottom 0.15: v45.47,43.4 45.47,43.35 TPB13.1 | v45.47,43.4 45.17,43.7 36.45,43.7 36.2,43.45 35.02,43.45 34.37,44.1 30.5,44.1 30,43.6 26.37,43.6 25.67,42.9 21.2,42.9 J15.4 | v50.45,24.61 50.17,24.88 50.17,27.27 49.17,28.28 49.17,29.2 49.07,29.3 v48.97,29.3 | v45.47,43.4
DBG_AP_JTAG_TDI  (via drill 0.25)
  Top 0.15: U12.M21 46.27,25.2 45.96,25.2 45.64,24.88 44.6,24.88 42.59,26.88 42.59,28.46 42.4,28.66 42.4,29.92 42.65,30.17 42.65,31.73 42.91,32 42.91,33.68 42.7,33.9 42.7,41.23 42.2,41.73 42.2,42.43 v42.42,42.65 | U12.M21
  Bottom 0: J15.8 | TPB15.1
  Bottom 0.15: v42.42,42.65 41.97,42.65 41.52,43.1 36.69,43.1 36.44,42.85 34.74,42.85 34.09,43.5 30.74,43.5 30.24,43 26.67,43 25.97,42.3 19.87,42.3 18.57,43.6 17.97,43.6 17.96,43.59 J15.8 | TPB15.1 44.04,42.35 43.88,42.2 43.12,42.2 42.67,42.65 v42.42,42.65 | v42.42,42.65
DBG_AP_JTAG_TDO  (via drill 0.25)
  Top 0.116: U12.M23 46.92,24.95 46.1,24.95 45.87,24.72
  Top 0.15: 45.87,24.72 45.73,24.58 44.49,24.58 42.31,26.75 42.31,28.35 42.12,28.54 42.12,30.04 42.37,30.29 42.37,31.88 42.62,32.13 42.62,33.56 42.42,33.77 42.42,41.05 41.9,41.58 41.9,43.07 v42.07,43.25 v42.07,43.24 | U12.M23
  Bottom 0: J15.6
  Bottom 0.15: J15.6 20.23,42.6 25.87,42.6 26.57,43.3 30.12,43.3 30.62,43.8 34.22,43.8 34.87,43.15 36.32,43.15 36.57,43.4 41.91,43.4 v42.07,43.24 43.18,43.24 TPB14.1
DBG_AP_JTAG_TMS  (via drill 0.25)
  Top 0.116: 48.17,25.3 48.17,25.48 47.9,25.75 47.71,25.75 U12.L24
  Top 0.15: 48.17,25.3 48.42,25.05 48.56,25.05 48.69,24.92 50.05,24.92 50.32,25.19 50.44,25.19 50.61,25.36 v50.64,25.36 | v46.09,43.6 46.1,39.59 47,38.69 47,36.94 49.55,34.39 49.55,32.22 49.97,31.79 49.97,30.84 49.32,30.19 49.32,29.85 v49.37,29.8
  Bottom 0.15: v46.09,43.6 47.17,43.6 TPB12.1 | v46.09,43.6 45.7,44 36.32,44 36.07,43.75 35.14,43.75 34.49,44.4 30.35,44.4 29.85,43.9 26.17,43.9 25.47,43.2 21.47,43.2 20.97,43.7 J15.2 | v46.09,43.6 | v50.65,25.36 v50.64,25.36 50.45,25.55 50.45,27.39 49.47,28.38 49.47,29.7 v49.37,29.8
  Bottom 0.254: J15.2
DBG_AP_JTAG_TRST_N  (via drill 0.25)
  Top 0.075: 45.31,26.09 45.31,26.08
  Top 0.116: 45.87,26.09 46.91,26.09 U12.K23
  Top 0.15: 45.31,26.09 45.87,26.09 | 45.31,26.08 45.13,26.08 45.08,26.03 43.94,26.03 42.87,27.09 42.87,28.58 42.68,28.77 42.68,29.81 42.92,30.06 42.92,31.6 43.2,31.87 43.2,33.82 42.97,34.05 42.97,41.4 42.82,41.55 42.82,41.81 v42.68,41.95 | v42.67,41.95 v42.68,41.95 | v42.68,41.95 v42.67,41.96
  Bottom 0.15: J15.10 16.69,43.6 17.42,43.6 17.77,43.25 18.27,43.25 19.52,42 26.07,42 26.77,42.7 30.37,42.7 30.87,43.2 33.97,43.2 34.62,42.55 36.57,42.55 36.82,42.8 41.37,42.8 42.22,41.95 v42.67,41.95 42.93,41.7 43.42,41.7 TPB16.1
DC_IN_5V_20V  (via drill 0.25 pad 0.5, 0.25 pad 0.51)
  Top 0.4: v44.22,6.35
  Top 0.5: v22.17,6.7
  Top 0.6: R83.1 22.01,37.67 v22.17,37.5 R81.1 | v31.62,8.5 31.62,15.8 30.12,17.3 v30.12,30.64
  Top 0.65: 22.17,8.29 FB1.1
  Top 0.7: v22.17,6.7 C50.1 | v21.47,6.7 C36.1
  Top 0.75: v22.17,6.7 22.17,8.29
  Top 0.8: v22.17,6.7 v21.47,6.7 21.47,8.8 D17.1 | v43.57,6.35 v44.22,6.35 44.22,4.85 45.47,3.6 45.47,2.79 J10.8
  Bottom 0.4: v44.22,6.35
  Bottom 0.5: v22.17,6.7
  Bottom 0.6: v31.62,8.5 | v30.12,30.64 30.12,30.75 23.67,37.2 22.47,37.2 v22.17,37.5
  Bottom 0.8: v44.22,6.35 v43.57,6.35 38.92,6.35 36.77,8.5 v31.62,8.5 29.92,8.5 28.87,7.45 24.62,7.45 23.87,6.7 v22.17,6.7 v21.47,6.7
  pour Top (rank 3, no thermals): 21.86,10.15 22.25,10.15 22.45,9.95 23.04,9.95 23.37,9.63 23.37,8.77 23.05,8.45 22.45,8.45 22.25,8.25 21.86,8.25
DC_IN_5V_20V_FIL
  Top 0.6: D18.2
  Top 0.65: D18.2 26.57,9.2 FB1.2
  pour Top (rank 3, no thermals): 25.89,10.35 25.79,10.35 25.39,9.95 24.39,9.95 24.07,9.63 24.07,8.77 24.39,8.45 25.91,8.45
DC_IN_JACK
  Top 0.4: J16.1
  Top 1.7: J16.1 15.93,8.26 D17.2
  Bottom 0.4: J16.1
  Bottom 1: J16.1 11.68,8.32 TPB20.1
EN_V3P3
  Top 0.15: U205.3 16.25,20.36 16.01,20.36 15.86,20.21 15.86,20.14 15.77,20.04 15.58,20.04 R89.2
ESR3_LX
  Top 0.3: U12.P4 38.64,23.42 | U12.P4 | U12.P4
  Top 0.35: 38.64,23.42 38.16,22.94 38.16,22.59
  Top 0.4: 38.16,22.59 37.97,22.4
  Top 0.5: 37.97,22.4 L12.1
GND  (via drill 0.25, 0.25 pad 0.5, 0.25 pad 0.51)
  Top 0: 48.36,25.56 47.97,25.94
  Top 0.075: 48.05,26 47.97,26 47.97,25.94 | v48.28,28.31 48.17,28.31 48.17,28.2 | U12.A24 v47.65,31.9 | J17.6
  Top 0.1: 46.87,30.65 46.13,30.65 45.99,30.79
  Top 0.116: 48.06,30.93 47.78,30.65 47.49,30.65 U12.C23
  Top 0.15: R73.2 | U12.A2 | U12.L21 | 48.06,31.11 48.06,30.93 | 47.67,31.51 U12.A24
  Top 0.2: v19.64,24.87 U204.8 | 46.02,25.81 U12.L21 | 45.32,25.67 v45.32,25.63 v45.32,25.62 v45.33,25.63 45.33,25.67 45.44,25.78 46,25.78 46.02,25.81
  Top 0.22: 47.67,26.38 48.05,26 48.07,26 48.49,25.59 48.56,25.59 48.6,25.55 v48.61,25.55 | U12.K24 47.67,26.38 | U12.K24 47.67,26.37 47.67,26.38
  Top 0.25: 17.92,46.18 J15.5 18.95,46.18 | J17.4 7.15,37.49 | 5.89,37.49 J17.4 | J17.4 7.15,36.22 | 5.89,36.22 J17.4 | v21.07,12.5 20.82,12.75 U10.6 | 20.32,13.33 20.32,13.95 20.82,14.45 | 20.32,13.33 20.32,12.55 v20.37,12.5 | U10.6 20.82,14.45 | 21.32,13.34 21.32,12.75 v21.07,12.5 | 21.32,13.34 21.32,14.45 U10.17 | U10.15 20.82,16 | 20.82,16 20.82,14.95 | U10.16 20.32,15.45 20.82,14.95 | 20.82,14.95 U10.17 | 20.82,14.45 U10.17 | U205.4 v16.32,19.45 | U205.5 v18.23,19.45 | U205.1 v16.32,22 | J10.6 41.32,3.22 | 39.97,3.22 J10.6 | J10.6 41.32,1.87 | 39.97,1.87 J10.6 | 42.51,3.22 J10.7 | J10.7 43.86,3.22 | 42.51,1.87 J10.7 | J10.7 43.86,1.87 | v47.97,23.7 47.97,23.78 U12.P24 | 48.17,28.2 47.77,28.2 U12.G24 | v45.15,28.15 45.47,28.15 45.52,28.2 45.94,28.2 45.99,28.15 46.01,28.15 46.07,28.09 U12.G21 | 65.49,26.08 J12.6 | J12.6 66.84,26.08 | 65.49,24.73 J12.6 | J12.6 66.84,24.73 | 25.74,51.48 J11.7 | J11.7 27.09,50.13 | J11.7 27.09,51.48 | 25.74,50.13 J11.7 | U10.5 20.32,13.33 | U10.6 | U10.7 21.32,13.34 | U10.15 20.82,16 | C55.2 18.78,36.46 | v36.77,23.9 37.1,23.9 U12.P1 | 37.74,31.87 | v45.92,22.6 45.92,24.29 U12.N21 | U12.P22 | v21.07,12.5 | U12.A2 37.74,31.87 | 37.74,31.87 v37.77,31.9 | 15.9,45.72 15.89,45.72 | J15.9 15.22,45.05 | 16.49,46.33 15.89,45.73 J15.9 15.29,46.28
  Top 0.254: SW12.4 | J15.5 | 47.67,31.51 48.06,31.11
  Top 0.3: U12.P22 46.75,23.87 47.22,23.4 v47.37,23.4 | ESD11.2 v13.27,40.6 | v12.57,37 12.77,37 12.82,37.05 13.02,37.05 13.03,37.04 ESD10.2 | U13.2 U13.5 v14.27,34.5 | ESD11.2 | ESD11.2 | v47.65,31.9 U12.A24 | v14.27,34.5 U13.2 U13.5
  Top 0.35: v20.19,28.17 R86.2 | v55.33,15.03 54.71,15.04 54.66,15.09 U15.1 | v48.61,37.65 U11.1 | U14.1 32.45,36.76 v32.68,36.52 | C53.2
  Top 0.4: v11.53,51.6 10.29,51.6 | 10.29,51.6 v9.13,51.6 | 2.71,51.65 SW12.4 | SW12.4 v1.17,51.65 SW12.4 | v17.42,42.23 U202.3 v17.42,42.23 | U202.2 v18.37,42.23 | v16.61,30.48 16.19,30.48 C49.2 | v11.17,34.1 11.37,34.3 C42.2 | v11.12,26.85 C19.2 | v2.87,21.4 2.87,20.83 SW10.2 2.87,19.84 v2.87,19.3 | v10.33,21.4 v10.33,19.3 v10.33,19.31 SW10.1 | C11.2 v11.94,17.97 | 7.32,5.21 7.34,5.19 | 7.32,2.21 7.34,2.22 | v24.57,12.2 24.31,12.46 | v34.27,17.7 C30.2 | C31.2 32.22,20.39 v32.22,20.25 | C32.2 32.17,22.76 v32.17,22.85 | v39.27,19.45 39.27,20.06 | 39.27,20.06 39.34,20.13 | 39.34,20.13 C33.2 | v31.52,29.85 32.08,29.85 C35.2 | v41.47,22.2 41.47,22.08 41.91,21.64 C25.2 | v56.92,12.94 C51.2 v56.92,12.94 | v55.57,20.9 v55.56,20.89 56.19,20.89 56.21,20.89 | v55.57,20.3 | v55.57,20.3 56.21,20.3 56.22,20.83 | v55.57,19.7 55.97,19.7 56.21,19.94 56.21,20.27 J18.2 v55.57,20.3 | 47.43,23.34 R24.2 | v47.37,23.4 47.43,23.34 | v53.42,23.45 52.75,23.45 C22.2 | v53.42,24.35 53.07,24.35 52.76,24.66 C21.2 | v53.12,30.9 52.92,30.9 52.06,30.04 C47.2 | v56.57,28.8 C46.2 | C46.2 | C53.2 49.71,47.06 v49.57,47.2 | v58.47,38 58.63,37.85 D10.2 58.62,37.85 v58.47,38 | 58.13,20.83 58.13,20.3 | v58.67,20.3 58.67,20.4 | v58.67,20.3 J18.4 | J18.4 58.13,20.3 | C2.2 C2.2 arc45 C2.2 | v59.62,15.65 L1.2 | v24.87,44.45 25.58,44.45 C41.2 | v28.37,41.4 D13.2 | SW12.4 | SW12.4 2.17,51.66 | SW12.4 2.71,51.66 2.71,51.65 | 2.71,51.65 v3.57,51.65 | SW12.3 10.29,51.62 10.29,51.6 | R57.2 v16.42,31.4 | C39.2 C39.2 arc-90 C39.2 | R73.2 | SH10.2 | C52.2 31.16,44.44 v31.62,44.9 | D13.2 | D13.2 | U16.3 27.17,40.1 v27.17,40.3 | 28.24,40.09 R65.2 28.31,40.09 28.31,40.1 | 28.23,40.1 28.31,40.1 | 28.31,40.1 v29.07,40.1
  Top 0.4: C29.2 v32.97,17.7 | C33.2 39.34,20.16 | 39.34,20.16 39.34,20.13 | J18.3 | 58.13,20.83 58.13,21.16 v58.37,21.4 | 58.13,20.83 58.14,20.81 58.14,20.82 58.14,20.83 | J18.4 | v58.27,19.15 58.27,19.78 58.13,19.92 58.13,20.3 | J16.3 | J16.2 | C39.2 v16.42,32.8 | 15.77,36.26 v15.77,37 | C15.2 24.31,12.46 v24.57,12.2 | C26.2 v41.91,19 | 39.34,20.16 39.27,20.08 39.27,20.06 | C2.2 58.67,20.4 | 58.67,20.4 v58.67,20.31 v58.67,20.3 | 47.43,23.34 arc-90 v47.37,23.4 | C20.2 53.42,25.5 v53.42,25.3 | C53.2 49.71,47.06 v49.57,47.2
  Top 0.406: R75.2 17.62,36.46 | L1.2 | J17.5
  Top 0.5: C55.2 18.78,36.46 17.62,36.46 R75.2 17.57,36.45 | J15.3 19.7,46.38 | v17.22,35.7 17.57,36.05 | R73.2 v17.57,30.5 | J16.3 7.08,9.76 | J16.3 4.07,9.76 | J16.3 4.07,6.75 | J16.3 7.08,6.75 | 10.31,5.19 J16.2 | 10.31,2.22 J16.2 | 7.34,5.19 J16.2 | 7.34,2.22 J16.2 | v19.43,7.55 C36.2 | v26.57,30.64 C17.2 | v36.47,15.66 C44.2 | C32.2 C45.2 | C32.2 C31.2 | C24.2 32.73,27.2 C23.2 | C24.2 C28.2 C45.2 | C23.2 32.23,27.7 C48.2 | v31.52,28.75 32.23,28.75 C48.2 | C48.2 C35.2 | v41.38,10.95 U201.4 | v44.07,11.56 R62.2 | C43.2 v46.03,9.45 | v55.77,19.1 C38.2 | J18.3 v57.17,21.9 | J17.6 2.65,45.29 | J17.6 4.98,45.29 | J17.6 4.98,42.96 | J17.6 2.65,42.96 | J17.5 2.65,33.25 | J17.5 4.98,33.25 | J17.5 4.98,30.92 | J17.5 2.65,30.92 | 17.57,36.05 v17.22,35.7 | SH10.2 18.95,30.78 v18.7,30.78 | 17.57,36.05 17.57,36.45 | 17.57,36.45 17.59,36.46 | C54.2 R82.2 | C50.2 24.77,6.7 v24.97,6.5 | C23.2 | C24.2 | C45.2 | C32.2 | J10.6 | J10.7 | C43.2 | C43.2 v46.03,9.45 | J18.3 v57.17,21.9 | U14.1 32.44,38.55 | U14.1 32.44,36.8 | 15.9,45.72 15.89,45.72 J15.9
  Top 0.6: J15.5 19.68,45.67 | 19.68,45.67 J15.3 | J15.3 19.68,45.67
  Top 0.65: J12.6
  Bottom 0.15: v48.61,37.65 v48.62,37.65 | v19.43,7.55 | v20.37,12.5 | v16.61,30.48 | v26.57,30.64
  Bottom 0.25: J10.6 41.32,3.22 | J10.6 41.32,1.86 | 39.96,3.22 J10.6 | 39.96,1.86 J10.6 | 42.5,3.22 J10.7 | 42.5,1.86 J10.7 | J10.7 43.86,3.22 | J10.7 43.86,1.86 | J17.4 7.15,37.48 | 5.89,37.48 J17.4 | 5.89,36.22 J17.4 | J17.4 7.15,36.22 | J12.6 66.84,26.08 | 65.49,26.08 J12.6 | 65.49,24.72 J12.6 | J12.6 66.84,24.72 | J11.7 27.09,51.48 | 25.74,51.48 J11.7 | J11.7 27.09,50.12 | 25.74,50.12 J11.7 | 18.95,46.18 J15.5 17.92,46.18 | v21.07,12.5 | v18.23,19.45 | 23.38,29.86 23.34,29.86 arc90 22.83,29.35 | 23.35,29.87 23.64,29.87 23.84,29.67 23.84,28.97 23.61,28.74 23.16,28.74 23.1,28.79 | J17.6 | 3.83,32.06 J17.5
  Bottom 0.4: v3.57,51.65 | J16.3 | J16.2 | v36.47,15.66 | J10.6 | v41.38,10.95 | v44.07,11.56 | v39.27,19.45 | v58.67,20.3 arc90 v58.67,20.3 | v45.92,22.6 arc90 v45.92,22.6
  Bottom 0.406: 3.83,32.06 4.25,31.65 | 45.88,38.68 arc-90 46.42,38.14 46.42,38.08 arc-90 45.87,37.54 45.83,37.54 arc-90 45.27,38.1 45.27,38.11 arc-90 45.85,38.69
  Bottom 0.5: J16.3 7.08,9.76 | J16.3 4.07,9.76 | J16.3 4.07,6.75 | J16.3 7.08,6.75 | 7.32,5.21 J16.2 | 10.33,5.21 J16.2 | 10.33,2.2 J16.2 | 7.32,2.2 J16.2 | J17.6 2.65,42.96 | J17.6 2.65,45.28 | J17.6 4.97,45.28 | J17.6 4.97,42.96 | J17.5 4.97,33.24 | J17.5 2.65,33.24 | J17.5 4.97,30.92 | J17.5 2.65,30.92 | J15.3 19.7,46.37
  Bottom 0.6: J15.5 J15.3
  other vias: 4.77,50.2 8.27,51.9 7.07,45.3 4.97,42.2 1.37,42.2 3.48,39.24 2.42,34.4 2.77,29 3.27,16.1 6.67,14.35 5.02,11.1 9.47,12 3.07,4.2 2.97,0.9 11.07,1.4 8.57,6.5 13.87,6.6 12.97,12 12.07,14.05 13.14,16.02 12.02,16.93 10.82,16.09 8.57,17.6 6.77,20.35 12.1,19.26 11.66,21.95 6.72,25.4 11.66,24.51 11.31,27.67 8.87,29.25 10.73,30.02 10.17,31.4 8.07,33.2 6.12,34.15 9.97,38.2 6.72,41.05 10.77,44.2 13.67,43 11.57,41.7 20.27,1.3 17.17,4.1 18.22,11.25 16.32,10.75 18.17,13.3 18.97,12.7 19.67,13.3 16.82,15.85 19.02,16 19.67,16 19.87,16.6 20.57,16.7 19.85,18.66 19.6,19.13 17.25,19.47 16.88,23.54 18.04,23.57 18.65,24.06 17.16,24.45 18,24.7 18.1,28.12 17.53,28.49 16.99,28.13 16.37,28.52 13.46,30.86 12.77,31.75 16.77,40.4 15.37,41.4 15.67,43.1 17.34,49.13 19.97,49 22.48,49.06 22.06,46.68 24.87,45.42 24.71,41.4 23.97,40.5 19.67,40.4 22.82,37.95 22.22,35.8 23.29,35.11 24.12,33.95 18.72,35 18.77,33.2 21.01,32.54 22.65,30.91 21.98,27.89 24.17,26.88 23.55,25.56 19.27,23.11 20.1,23.49 20.78,23.06 21.31,18.43 22.16,17.51 22.83,17.48 22.84,16.64 22.22,16.68 22.47,13.3 24.67,13.1 26.37,10.9 23.67,7.65 22.27,5.8 25.02,2.6 28.12,3.85 28.37,6.65 31.02,4.75 30.67,9.55 28.42,12.2 30.72,14.55 27.37,16.1 24.07,18.55 24.07,18 24.62,18 24.62,18.55 25.17,18.55 25.17,18 25.72,18 25.72,18.55 26.32,18.55 26.27,18 28.92,19.2 28.52,20.48 27.15,21.97 26.85,23.02 28.96,23.1 29.01,27.2 27.49,27.33 29.52,41.89 26.47,46.5 27.67,49.1 30.37,46.9 33.02,47.4 33.47,49.35 35.97,47.25 32.57,41.65 31.77,40.8 30.98,38.78 33.69,40.53 32.45,39.53 25.27,38.55 27.92,37.85 27.07,35.85 27.79,35.23 28.53,35.12 29.46,35.12 28.81,30.39 26.44,29.85 30.05,31.96 30.84,31 32.17,1.4 35.37,4.2 33.37,7.7 33.54,9.5 35.67,9.8 32.97,11.6 31.14,36.91 31.95,35.35 32.06,33.16 32.48,32.16 32.83,30.72 33.65,30.86 32.22,18.85 38.27,5.45 40.27,7.3 46.27,6.6 43.83,7.28 42.77,8.4 44.59,8.4 44.57,9.98 42.96,9.98 39.72,11 38.46,11.36 36.72,12.45 40.07,13.03 42.57,13.6 44.82,12.45 37.97,14.2 40.52,15.7 42.27,16.2 38.89,18.43 37.37,18.75 35.43,18.28 36.87,20.6 34.87,20.55 35.77,22.5 34.92,23.65 38.8,22.75 41.34,23.12 43.05,21.02 33.67,33.22 33.63,35.36 34.62,35.8 33.26,36.06 34.15,38.98 37.8,39.02 37.63,40.44 36.01,40.37 38.97,36.6 41.95,36.52 40.81,38.68 41.02,40.44 35.57,41.96 38.47,42.07 40.94,42.02 40.43,46.08 39.77,47.7 37.93,49.08 43.83,50.18 43.97,47.35 46.67,47.15 44.37,43.23 48.47,48.95 48.27,43.7 50.82,41.25 47.84,41.27 45.12,40.2 43.72,37.23 45.52,36.97 47.72,38.1 38.19,33.51 39.19,33.44 41.95,33.7 50.32,33.8 48.57,33.75 47.31,33.72 46.03,33.45 44.98,33.68 44.82,32.85 41.91,30.49 45.23,20.98 46.59,22.05 48.53,20.88 48.01,20.07 48.72,17.8 45.27,18.1 44.33,16.88 45.91,16.75 47.47,15.95 45.77,15.55 48.63,2.98 50.52,4.15 52.97,3.75 54.57,0.9 59.77,1.5 60.32,3.95 57.12,3.05 54.82,4.5 56.87,5.3 60.67,6.6 60.67,7.6 60.63,8.58 60.63,9.58 60.63,10.58 60.63,11.58 60.63,12.58 60.63,13.58 60.63,14.58 59.73,14.58 58.63,15.78 57.43,15.88 48.27,6.6 53.32,6.4 53.52,7.95 58.77,8.8 56.97,10.45 57.93,12.48 56.03,13.98 54.42,11.3 52.36,11.13 52.72,12.6 50.12,11.15 48.37,13.45 50.57,14.1 52.52,14.3 56.23,15.88 55.23,15.88 53.37,17.1 53.12,17.95 53.12,18.8 53.12,19.65 53.12,20.6 53.13,21.58 53.14,22.38 49.97,19.1 50.82,19.85 51.17,20.9 58.92,19.2 58.92,18.4 58.23,18.18 60.53,21.58 59.73,21.58 58.93,21.58 55.83,21.98 55.82,23.1 58.53,23.08 60.53,23.18 61.53,23.78 62.53,23.78 63.53,23.78 64.53,23.78 65.53,23.78 66.53,23.78 67.53,23.78 55.82,24.15 57.52,24.7 61.42,26.15 64.37,26.9 67.47,26.7 55.82,25.4 53.49,26.47 55.83,26.68 55.83,27.78 58.72,27.05 60.97,29.2 53.27,30 54.02,30 54.77,30 55.47,29.65 54.04,31.56 56.82,31.55 67.33,32.48 62.67,32.55 61.07,32.85 63.83,36.58 60.67,35.7 57.07,35.1 52.92,33.05 64.33,40.28 59.97,41.8 65.03,44.38 63.02,48.85 60.07,48.5 57.27,45.95 57.62,48.8 53.57,47.7 54.02,49.7 52.07,49.35 50.82,48.95 55.52,41.05 12.74,17.98
  pour Bottom (rank 4): 18.92,52.79 11.02,52.79 10.52,52.29 7.48,52.29 6.98,52.79 1.24,52.79 1.03,52.79 1.01,52.79 arc90 0.55,52.34 0.55,1.44 0.55,1.14 0.55,1.01 arc90 1,0.55 6.98,0.55 7.48,1.05 10.52,1.05 11.02,0.55 31.98,0.55 32.48,1.05 35.52,1.05 36.02,0.55 56.98,0.55 57.48,1.05 60.52,1.05 60.99,0.58 61.01,0.58 61.01,14.93 59.87,14.93 59.87,16 59.23,16 59.23,19.53 58.68,19.53 58.68,21.23 61.01,21.23 61.01,23.42 68.03,23.42 68.03,36.86 65.49,39.4 65.49,51.59 64.29,52.79 61.02,52.79 60.52,52.29 57.48,52.29 56.98,52.79 36.02,52.79 35.52,52.29 32.48,52.29 31.98,52.79
  pour Top (rank 4, no thermals): 6.98,52.8 1.02,52.8 arc90 0.54,52.35 0.54,1 arc90 0.99,0.54 6.98,0.54 7.48,1.04 10.52,1.04 11.02,0.54 31.98,0.54 32.48,1.04 35.52,1.04 36.02,0.54 56.98,0.54 57.49,1.04 60.52,1.04 61.02,0.54 61.02,0.54 61.02,14.94 59.88,14.94 59.88,16.01 59.24,16.01 59.24,19.54 58.69,19.54 58.69,21.22 61.02,21.22 61.02,23.41 68.04,23.41 68.04,36.86 65.5,39.4 65.5,51.59 64.29,52.8 61.02,52.8 60.52,52.3 57.48,52.3 56.98,52.8 36.02,52.8 35.52,52.3 32.48,52.3 31.98,52.8 11.02,52.8 10.52,52.3 7.48,52.3 7.18,52.6
  pour Top: 20.17,31.76 18.97,31.76 arc90 18.91,31.7 18.91,31.6 arc90 19.47,31.04 19.67,31.04 arc90 20.23,31.6 20.23,31.7 arc90
I2S_TSCK/IO18_3V_IO2  (via drill 0.25 pad 0.5)
  Top 0.116: U12.C2 37.46,30.65 37.17,30.65
  Top 0.15: 37.17,30.65 36.82,30.65 36.37,31.1 36.37,34.1 v36.77,34.5 | U12.C2 | v53.7,36.65 U11.8
  Bottom 0.15: v53.7,36.65 53.7,36.52 52.1,34.93 44.39,34.93 44.27,35.05 43.52,35.05 42.77,34.3 36.97,34.3 v36.77,34.5
I2S_TWS/IO19_3V_IO4  (via drill 0.25 pad 0.5)
  Top 0.15: v36.67,35.15 v36.66,35.15 36.06,34.55 36.06,31.01 36.71,30.37 U12.C1 | U11.6 52.4,36.74 | v52.4,36.65 52.4,36.74 | v52.39,36.65 52.4,36.74 | U11.6 | U11.6
  Bottom 0.15: v36.67,35.15 36.82,35.3 37.57,35.3 37.97,34.9 42.47,34.9 43.22,35.65 44.57,35.65 44.69,35.53 51.4,35.53 52.4,36.52 v52.39,36.65
I2S_TXD/IO20_3V_IO7  (via drill 0.25 pad 0.5)
  Top 0.15: U12.D1 36.48,29.8 35.47,30.8 35.47,31.15 35.12,31.5 35.12,34.5 35.42,34.8 35.42,35.45 v35.57,35.6 | v50.45,36.65 U11.3
  Bottom 0.15: v35.57,35.6 35.87,35.9 37.57,35.9 37.77,36.1 38.52,36.1 38.82,35.8 42.02,35.8 42.77,36.55 45.02,36.55 45.14,36.43 50.23,36.43 v50.45,36.65 v50.44,36.65 v50.45,36.65 | v35.57,35.6
IO0/RXD
  Top 0.15: J13.1 59.5,46.8 56.37,46.8 55,45.43 U11.11
IO1/TXD
  Top 0.15: J13.2 58.16,48 56.07,48 54.35,46.28 U11.12
IO2
  Top 0.15: J13.3 56.72,49.1 55.67,49.1 53.7,47.13 U11.13
IO3/PWM0
  Top 0.15: J13.4 53.05,47.97 U11.14
IO4
  Top 0.15: J13.5 53.34,49.69 52.4,48.75 U11.15
IO5/PWM1
  Top 0.15: J13.6 50.8,49.67 51.75,48.73 U11.16
IO6/PWM2
  Top 0.15: J13.7 51.1,47.97 U11.17
IO7
  Top 0.15: J13.8 48.22,48.3 49.37,48.3 50.45,47.23 U11.18
IO8
  Top 0.15: J11.1 41.66,48.59 38.3,45.23 U14.11 | J11.1 | J11.1
IO9/PWM3
  Top 0.15: U14.12 37.65,45.93 39.12,47.4 J11.2
IO10/SS
  Top 0.15: U14.13 37,47.03 36.58,47.45 J11.3
IO11/MOSI  (via drill 0.25 pad 0.5)
  Top 0.15: U14.14 36.35,45.28 v36.43,45.36 36.33,45.45 36.33,46.24 34.04,48.54 J11.4
  Bottom 0.075: J12.4
  Bottom 0.15: J12.4 64.95,29.16 64.95,31.82 63.07,33.7 63.07,35.8 53.67,45.2 36.58,45.2 v36.43,45.36
IO12/MISO  (via drill 0.25 pad 0.5)
  Top 0.15: 35.7,44.53 U14.15 | 35.7,44.53 v35.72,44.55 35.72,45.45 31.5,49.68 J11.5 | v35.72,44.55 35.7,44.53
  Bottom 0.15: J12.1 63.63,32.29 62.47,33.45 62.47,35.55 53.42,44.6 35.77,44.6 v35.72,44.55
IO13/SCK  (via drill 0.25 pad 0.5)
  Top 0.15: J11.6 33.46,46.3 33.87,46.3 35.05,45.12 35.05,44.56 v35.04,44.55 35.05,44.56 U14.16
  Bottom 0.075: J12.3 63.57,28
  Bottom 0.15: J12.3 63.57,28 62.17,29.4 62.17,35.43 53.3,44.3 36.2,44.3 35.95,44.05 35.55,44.05 v35.04,44.55
IO14_NEW  (via drill 0.25 pad 0.51)
  Top 0.15: U14.17 34.4,42.2 31.94,39.75 31.94,36.58 32.45,36.07 32.45,35.92 33.21,35.16 33.21,31.74 32.07,30.61 31.56,30.61 30.96,30 30.96,17.67 32.47,16.15 32.47,5.4 v32.07,5
  Bottom 0.15: J10.1 29,3.6 30.67,3.6 v32.07,5
LDO1P8_OUT
  Top 0.25: 37.04,25.75 37.09,25.81 U12.L1
  Top 0.3: 36.45,25.82 36.52,25.75 37.04,25.75
  Top 0.4: C48.1 | 36.45,25.82 35.45,25.82 34.58,26.69 34.58,28.3 34.53,28.35 34.48,28.35 34.47,28.35 34.12,28.7 33.64,28.7 C48.1 | C48.1
M_RESET  (via drill 0.25 pad 0.5, 0.25 pad 0.51)
  Top 0.116: 45.97,29.55 46.01,29.51 46.92,29.51 U12.D23
  Top 0.15: v10.36,29 R13.2 | v10.37,29.01 v10.36,29 | 45.97,29.55 45.62,29.55 45.21,29.96 44.98,29.96 44.86,30.09 v44.36,30.09 | v31.98,31.56 v31.99,31.56 31.88,31.46 30.66,31.46 30.41,31.21 26.48,31.21 25.23,29.95 v22.52,29.95 | v10.36,29 v10.37,29
  Bottom 0.15: v10.37,29 11.31,29.95 v22.52,29.95 | v44.36,30.09 v44.35,30.1 44.07,30.1 43.23,30.94 40.71,30.94 39.87,31.78 39.87,32.12 39.37,32.62 38.9,32.62 38.77,32.75 36.52,32.75 36.3,32.52 34.06,32.52 33.09,31.56 v31.98,31.56
M_RESET_R  (via drill 0.25 pad 0.51)
  Top 0.15: v9.07,24.84 SW10.3 | v9.07,24.84 9.07,26.06 9.08,26.07 C19.1 | C19.1 R13.1 | SW10.4 2.43,24.84 v4.63,24.84 v4.63,24.83 | C19.1 | v9.07,24.84 v9.07,24.83
  Top 0.406: SW10.4 2.43,24.84
  Bottom 0.15: v9.07,24.83 v4.63,24.83
MISO1/IO9_3V_IO8
  Top 0.116: U12.E3 38.48,29.51 39.07,29.51 | 38.91,30.65 38.03,30.65 U12.B2
  Top 0.15: 39.07,29.51 39.29,29.51 39.7,29.11 40.13,29.11 40.34,29.31 40.34,31.11 40.14,31.31 | 40.14,31.31 40.14,32.48 40.3,32.64 40.3,34.57 38.3,36.58 U14.10 | U14.10 | U14.10 | 40.14,31.31 39.57,31.31 38.91,30.65 | U12.B2 | U12.E3
N$1  (via drill 0.25 pad 0.5)
  Top 0.075: v26.56,28.8
  Top 0.25: U12.K4 | 38.94,26.38 38.95,26.38 | v39.07,26.25 v39.06,26.26 38.94,26.38 | 38.94,26.38 U12.K4
  Top 0.5: C17.1 | R59.1 v26.56,28.8 27.06,29.3 27.31,29.3 C17.1 | C17.1 | C17.1 27.31,29.3 27.06,29.3 v26.57,28.8 v26.57,28.79
  Bottom 0.075: v26.56,28.8 v26.57,28.8 v26.56,28.8
  Bottom 0.5: v26.56,28.8 27.4,27.97 29.44,27.97 30.65,26.76 38.32,26.76 38.81,26.26 v39.06,26.26 | v39.06,26.26 | v39.06,26.26
N$2
  pour Top: 66.16,10.99 66.02,10.99 arc92 62.67,7.58 arc86 65.95,4.25 arc21 67,4.39 67.95,5.34 67.95,5.66 67.95,10.39 67.92,10.42 67.8,10.5 67.67,10.58 67.54,10.64 67.42,10.7 67.22,10.78 67.02,10.85 66.87,10.89 66.7,10.93 66.51,10.96 66.42,10.97
N$8
  Top 0.116: 36.87,24.38 37.46,24.38 U12.N2
  Top 0.15: 36.87,24.38 36.58,24.38 36.45,24.25 34.76,24.25 C45.1 | U12.N2
N$178  (via drill 0.25 pad 0.5)
  Top 0.116: 48.07,29.9 47.97,29.8 47.97,29.65 47.83,29.51 47.49,29.51 U12.E23
  Top 0.15: U204.4 20.71,27.29 R86.1 | R86.1 21.25,27.41 21.44,27.6 21.44,29.53 22.33,30.42 25.3,30.42 26.37,31.49 30.29,31.49 30.54,31.73 31.39,31.73 32.57,32.92 32.57,34.58 v32.38,34.77 | U204.4 | U204.4 | R86.1 | U12.B4 38.8,30.94 39.86,31.99 39.86,33.25 v39.83,33.28 v39.83,33.27 | 48.07,29.9 48.18,30.01 48.33,30.01 49.39,31.08 49.39,31.55 48.97,31.98 48.97,32.7 v48.77,32.9 | R30.2 50.79,32.44 v50.17,33.05
  Bottom 0.15: 48.37,32.9 48.27,33 46.92,33 46.27,32.35 46.27,32 46.05,31.77 45.58,31.77 45.38,31.97 44.09,31.97 43.67,32.39 41.58,32.39 41.25,32.73 40.09,32.73 39.83,32.99 v39.83,33.27 | v39.83,33.27 39.83,33.51 39.36,33.98 36.59,33.98 35.93,34.64 34.43,34.64 34.31,34.77 v32.38,34.77 | 48.37,32.9 | 48.37,32.9 v48.77,32.9 arc90 v48.77,32.9 50.02,32.9 v50.17,33.05 | v39.83,33.27 39.82,33.28 v39.83,33.27
N$309  (via drill 0.25 pad 0.5)
  Top 0.15: 14.29,27.59 R92.1 | 14.29,27.59 v14.28,27.58 | v14.28,27.58 14.29,27.59
  Bottom 0.15: v14.28,27.58 14.51,27.35 22.52,27.35 24.07,25.8 24.07,25.6 24.07,25.13 24.07,25.12 24.54,24.65 26.15,24.65 v26.49,24.31
  pour Top (rank 3, no thermals): 28.56,26.95 27.72,26.95 27.2,26.43 27.2,25.28 26.97,25.05 26.3,25.05 26.24,24.99 26.24,24.32 26.37,24.19 28.47,24.19 28.56,24.28
N$816  (via drill 0.25 pad 0.5)
  other vias: 47.37,5
N$920
  Top 0: 25.91,25.1 25.98,25.03
N$947
  Top 0: 56.42,20.11 56.5,20.03
N$948
  Top 0: 56.42,20.49 56.42,20.11
N$950
  Top 0: 56.5,20.57 56.42,20.49
N$952
  Top 0: 56.5,19.82 56.45,19.82
N$957
  Top 0: 57.9,19.82 57.84,19.82
N$960
  Top 0: 57.84,20.03 57.92,20.11
N$962
  Top 0: 57.92,20.11 57.92,20.49
N$1026
  Top 0.5: 34.01,20.9 34.17,20.9
N$1039
  Top 0.5: 25.73,28.8 25.72,28.8
N$1048
  Bottom 0.15: 41.82,28.15
N$1074
  Bottom 0.15: 39.87,30.21
N$1085
  Bottom 0.15: 41.56,28.65 41.56,28.64
N$1125
  Bottom 0.15: 41.18,28.65 41.17,28.65
N$1126
  Bottom 0.15: 41.18,28.64 41.18,28.65
N$1143
  Bottom 0.15: 37.36,34.84 37.37,34.84
N$1158
  Bottom 0.15: 36.67,35.15 36.67,35.14
N$1301
  Bottom 0.15: 24.07,25.12 24.07,25.13
N$1302
  Bottom 0.15: 24.07,25.13
N$2764
  Bottom 0.23: 1.07,16.1 1.17,16.15
N$2765
  Bottom 0.23: 1.14,14.36 1.04,14.29
N$2766
  Bottom 0.23: 0.99,14.21 0.97,14.12
N$2767
  Bottom 0.23: 1.94,9.73 1.97,9.64
NOR_SWD_SCL  (via drill 0.25)
  Top 0.116: 48.11,30.29 47.65,29.83 U12.D24
  Top 0.15: 48.11,30.29 48.21,30.29 48.92,31 v48.92,31.35
  Bottom 0.15: 48.97,31.4 TPB11.1 | 48.97,31.4 v48.92,31.35 48.97,31.4
NOR_SWD_SDA  (via drill 0.25)
  Top 0.116: 48.07,29.3 47.97,29.3 47.9,29.23 U12.E24
  Top 0.15: 48.07,29.3 48.12,29.3 v48.37,29.55
  Bottom 0.15: TPB10.1 48.67,29.85 v48.37,29.55
OPM_2P6_DIS
  Top 0.254: U204.12 22.95,24.88 R88.2
PFET_ON
  Top 0.15: U204.14 22.79,25.91 22.98,26.09 24.56,26.09 25.25,25.4 U203.1 25.62,25.43 25.64,25.43 R84.1
PG_V3P3
  Top 0.25: U205.8 18.28,21.49 18.28,22.91 19.37,24 R90.1 | U204.10 21.11,24.43 21.06,24.43 21.06,24.06 R90.1 | R90.1 | U204.10 | U204.10
PV_BATT
  Top 0.25: 36.1,25.28 36.15,25.33 37.2,25.33 U12.M1 | U12.M1 | U12.M1 | 33.92,26.19 34.01,26.19 C24.1 | C23.1
  Top 0.4: C23.1 33.92,27.29 33.92,26.19 34.84,25.28 36.1,25.28
PWM0/SS10_3V_IO3  (via drill 0.25 pad 0.5)
  Top 0.15: U12.H1 37.01,27.8 36.8,27.8 35.3,29.3 34.85,29.3 34.39,29.76 v34.39,30.62 | v36.85,31.98 36.72,31.85 36.72,31.15 36.94,30.94 U12.B1 | v36.85,31.98 36.72,32.1 36.72,33.75 37.37,34.4 v37.37,34.84 | v37.37,34.84 v37.37,34.85 v37.37,34.84 | v37.37,34.84 | v37.37,34.84 v37.36,34.84 | v53.04,36.65 v53.05,36.65 arc90 v53.05,36.65 U11.7 | v36.84,31.97 v36.85,31.97 v36.85,31.98